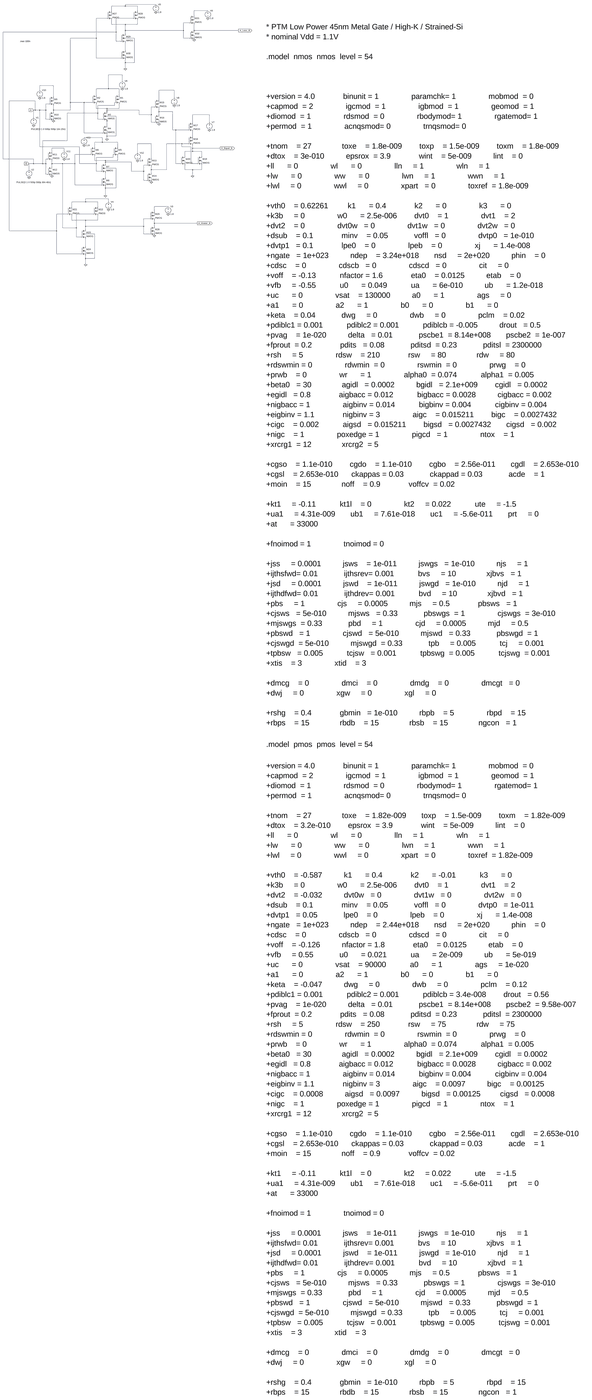
[diagram p0: schematic comparator-static-45nm.asc, whole sheet]
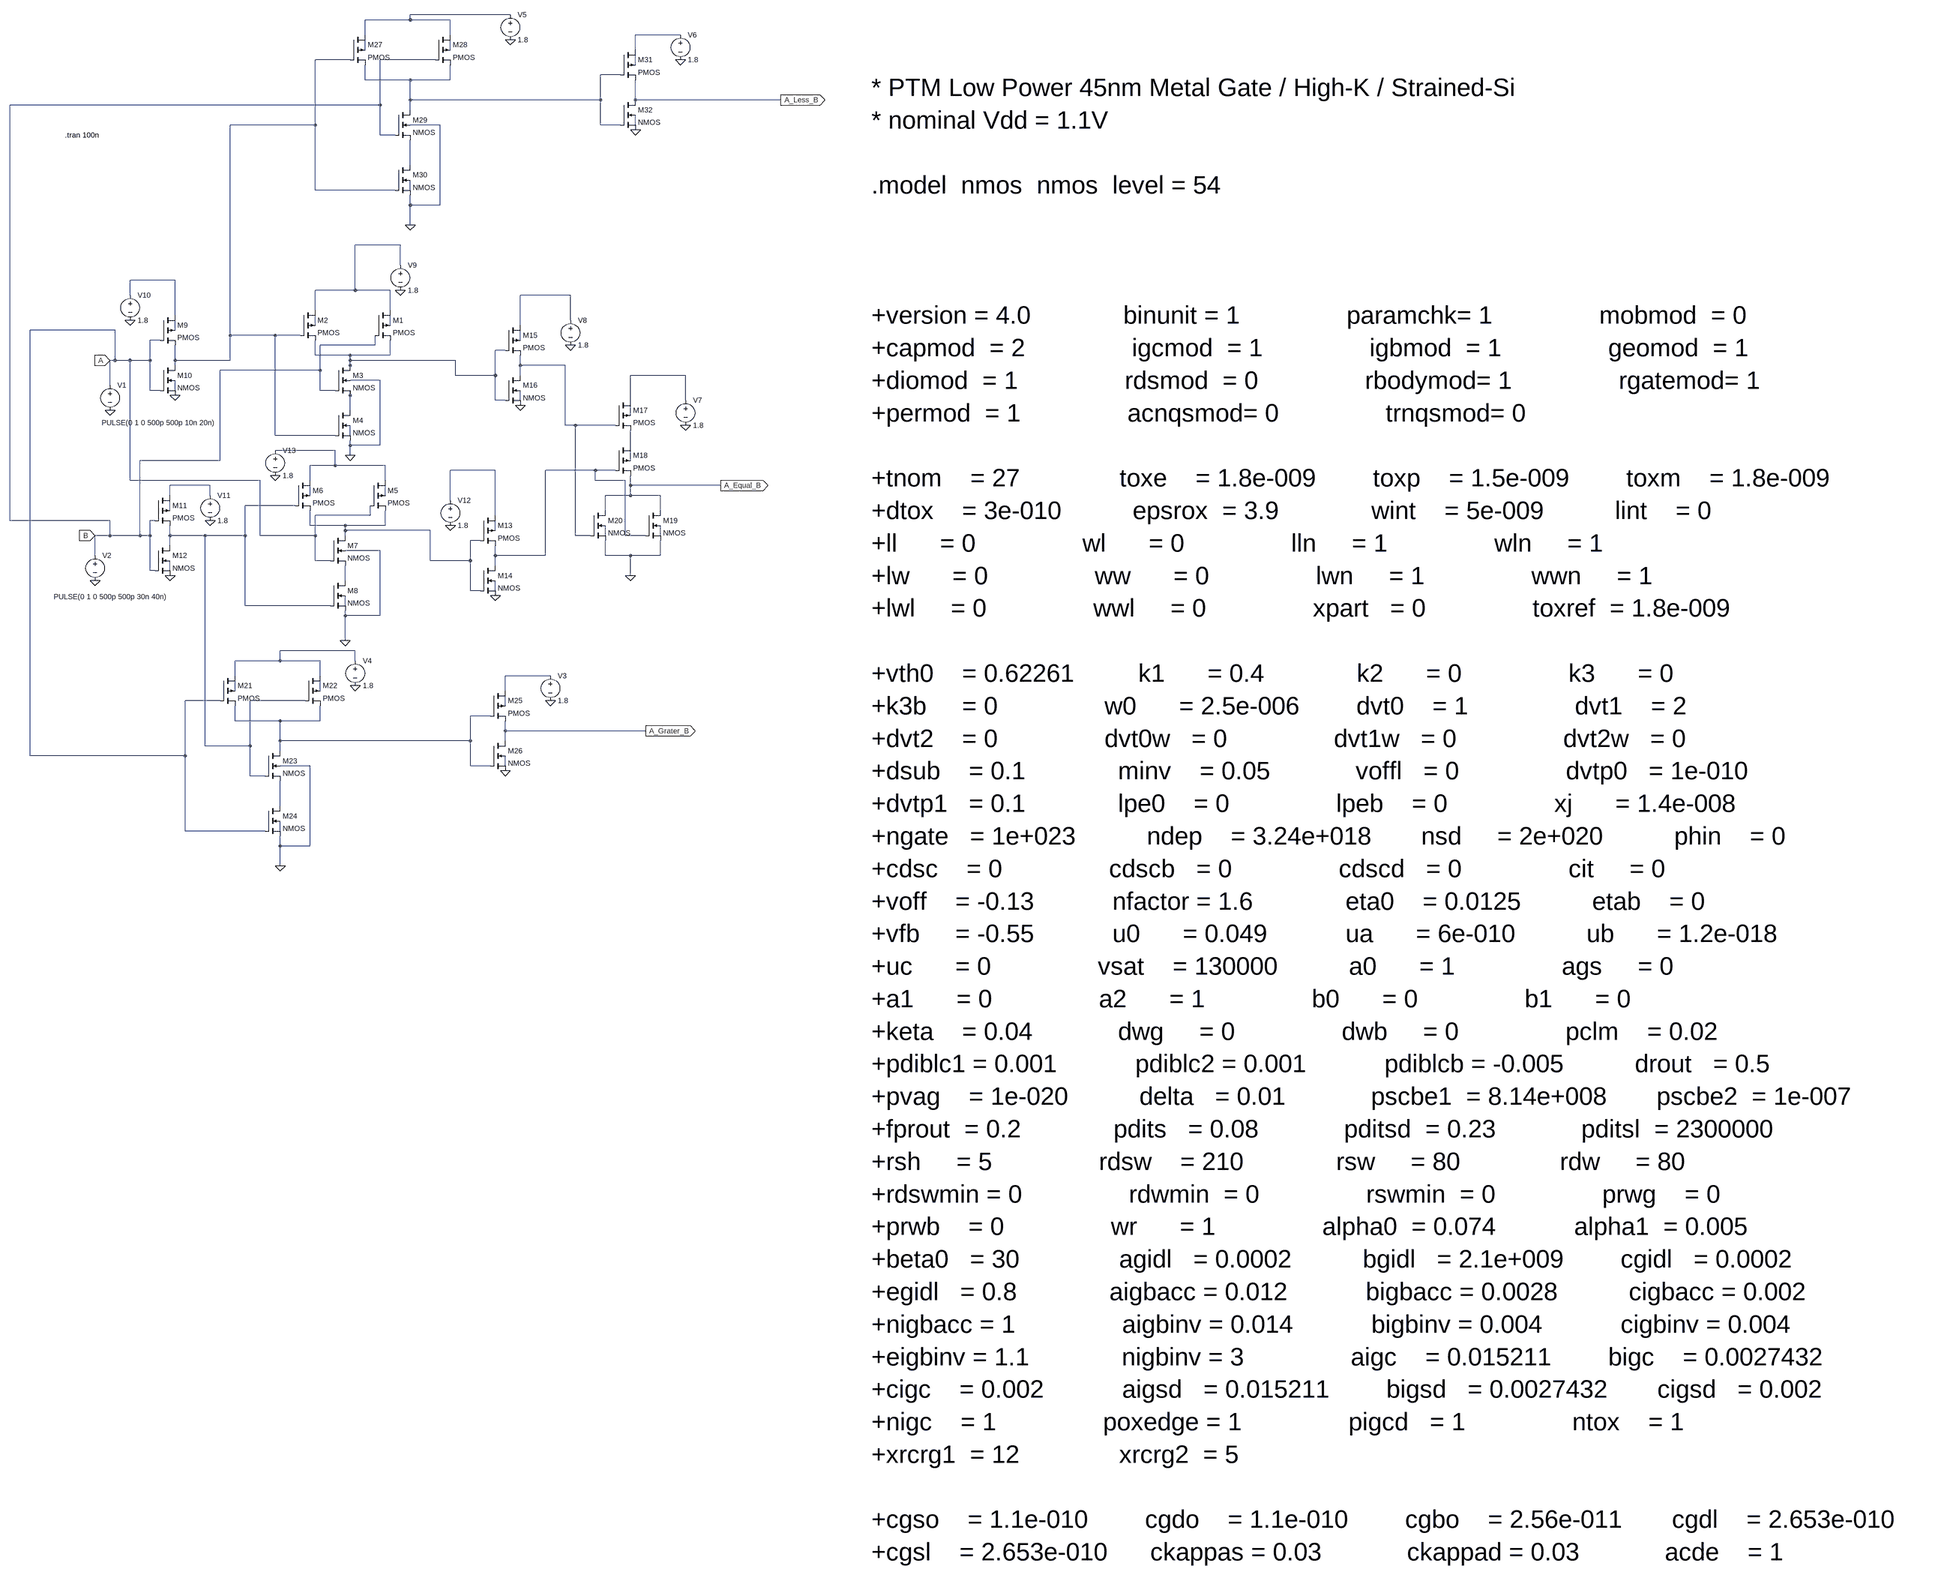
[diagram p1: schematic comparator-static-45nm.asc, part, row 1 of 3, column 1 of 1]
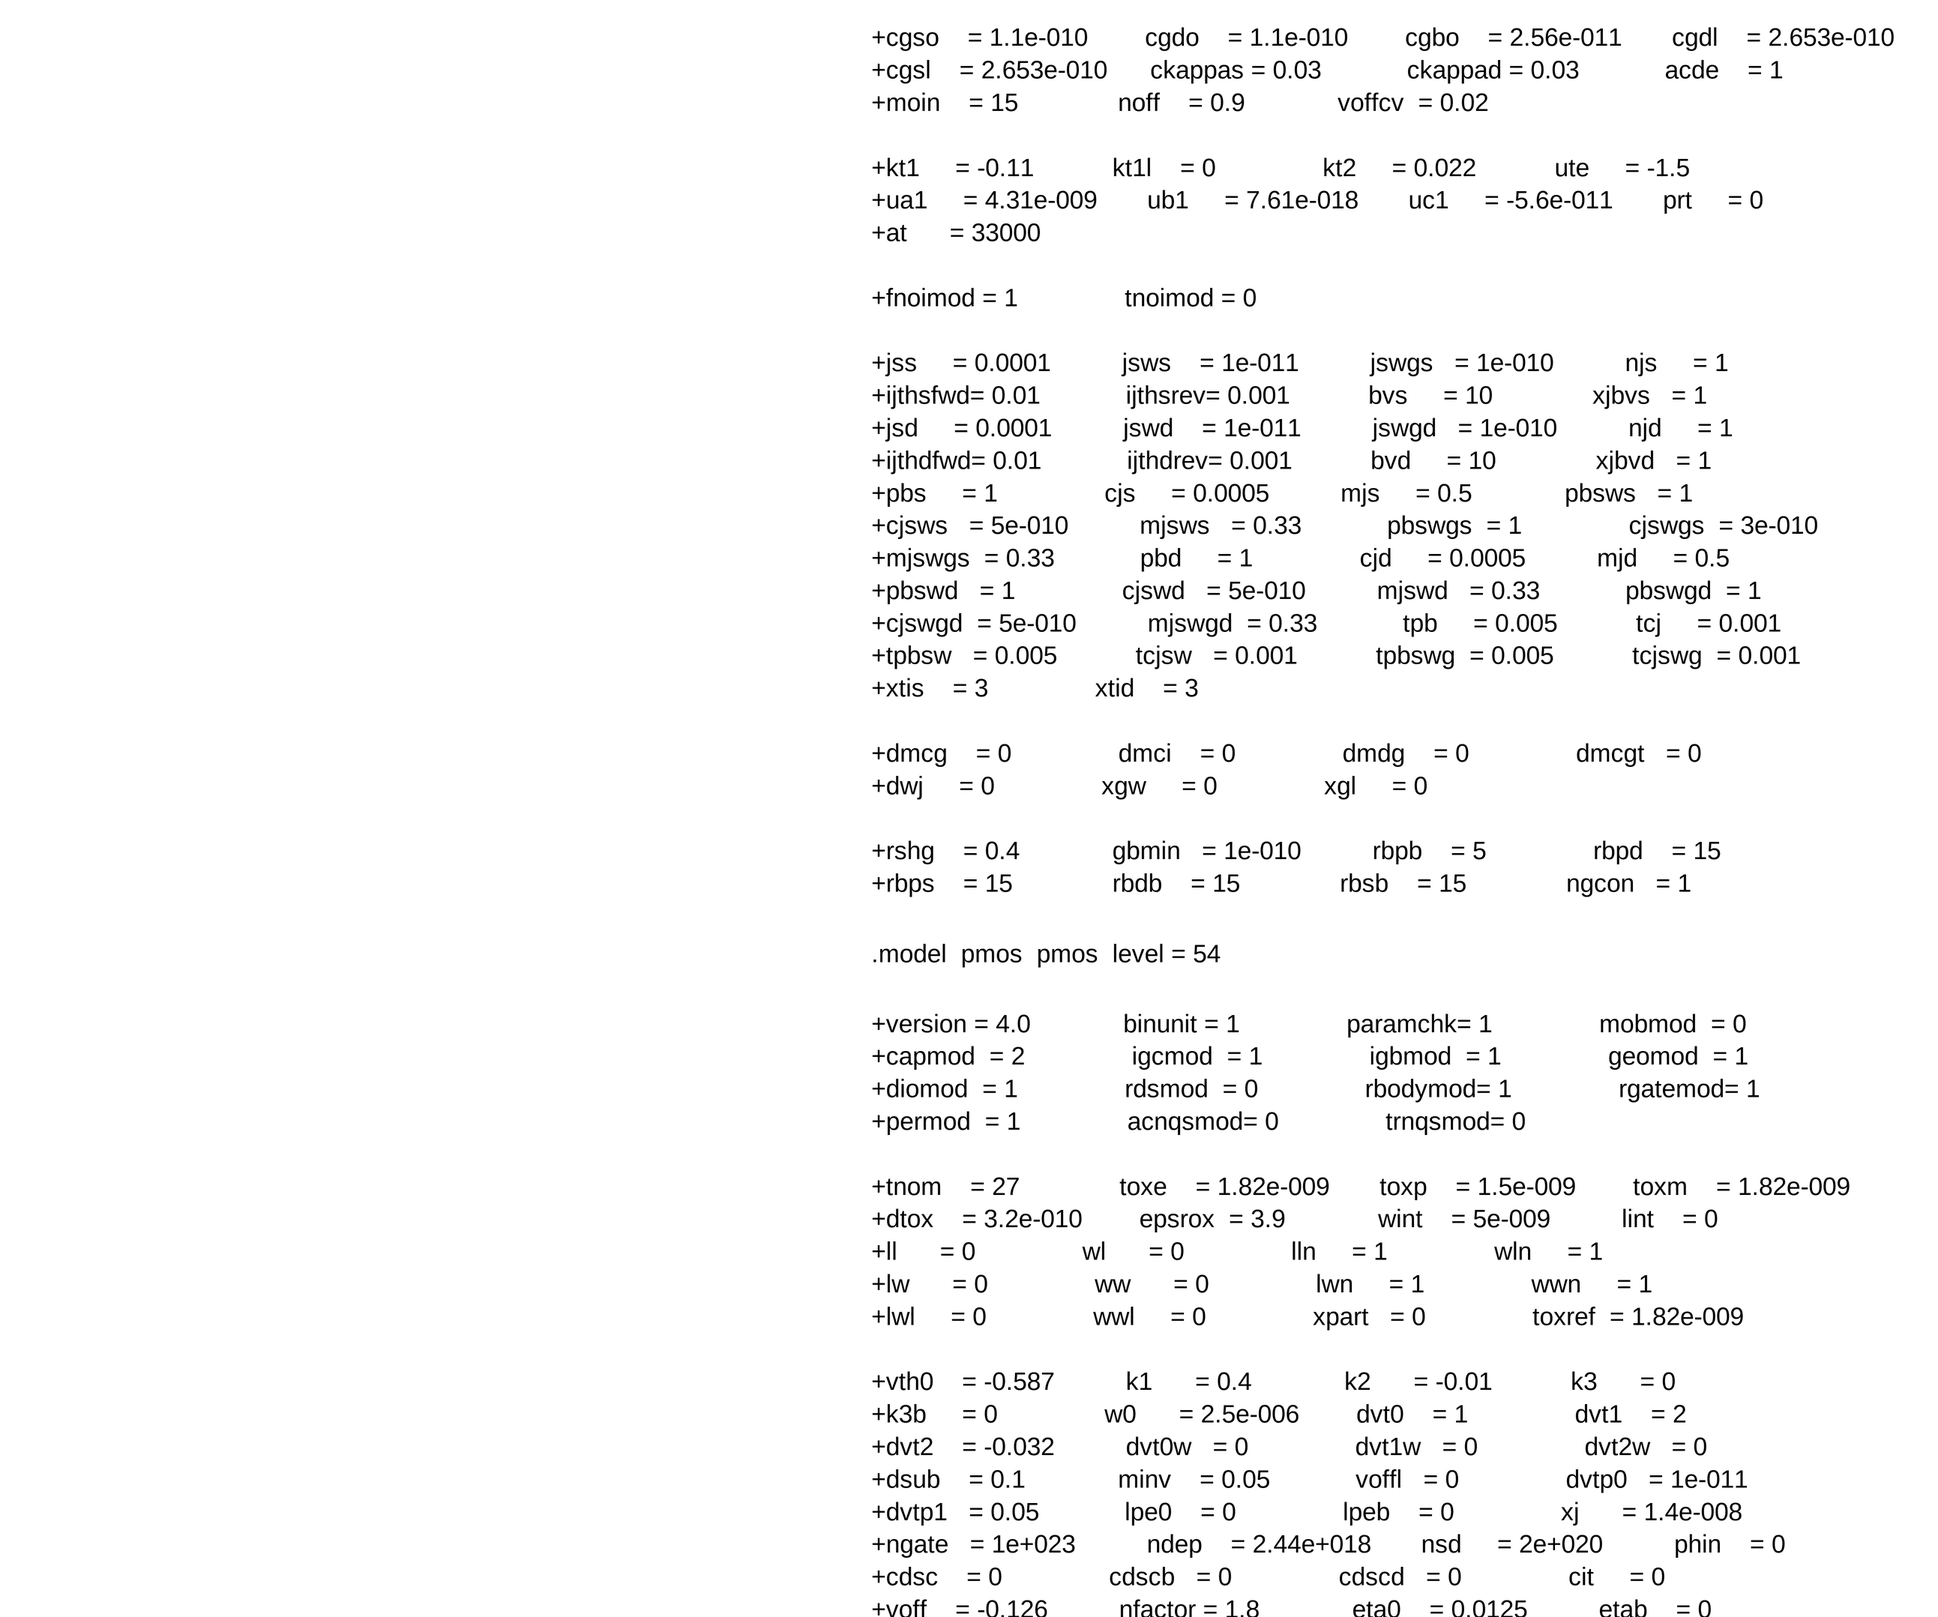
[diagram p2: schematic comparator-static-45nm.asc, part, row 2 of 3, column 1 of 1]
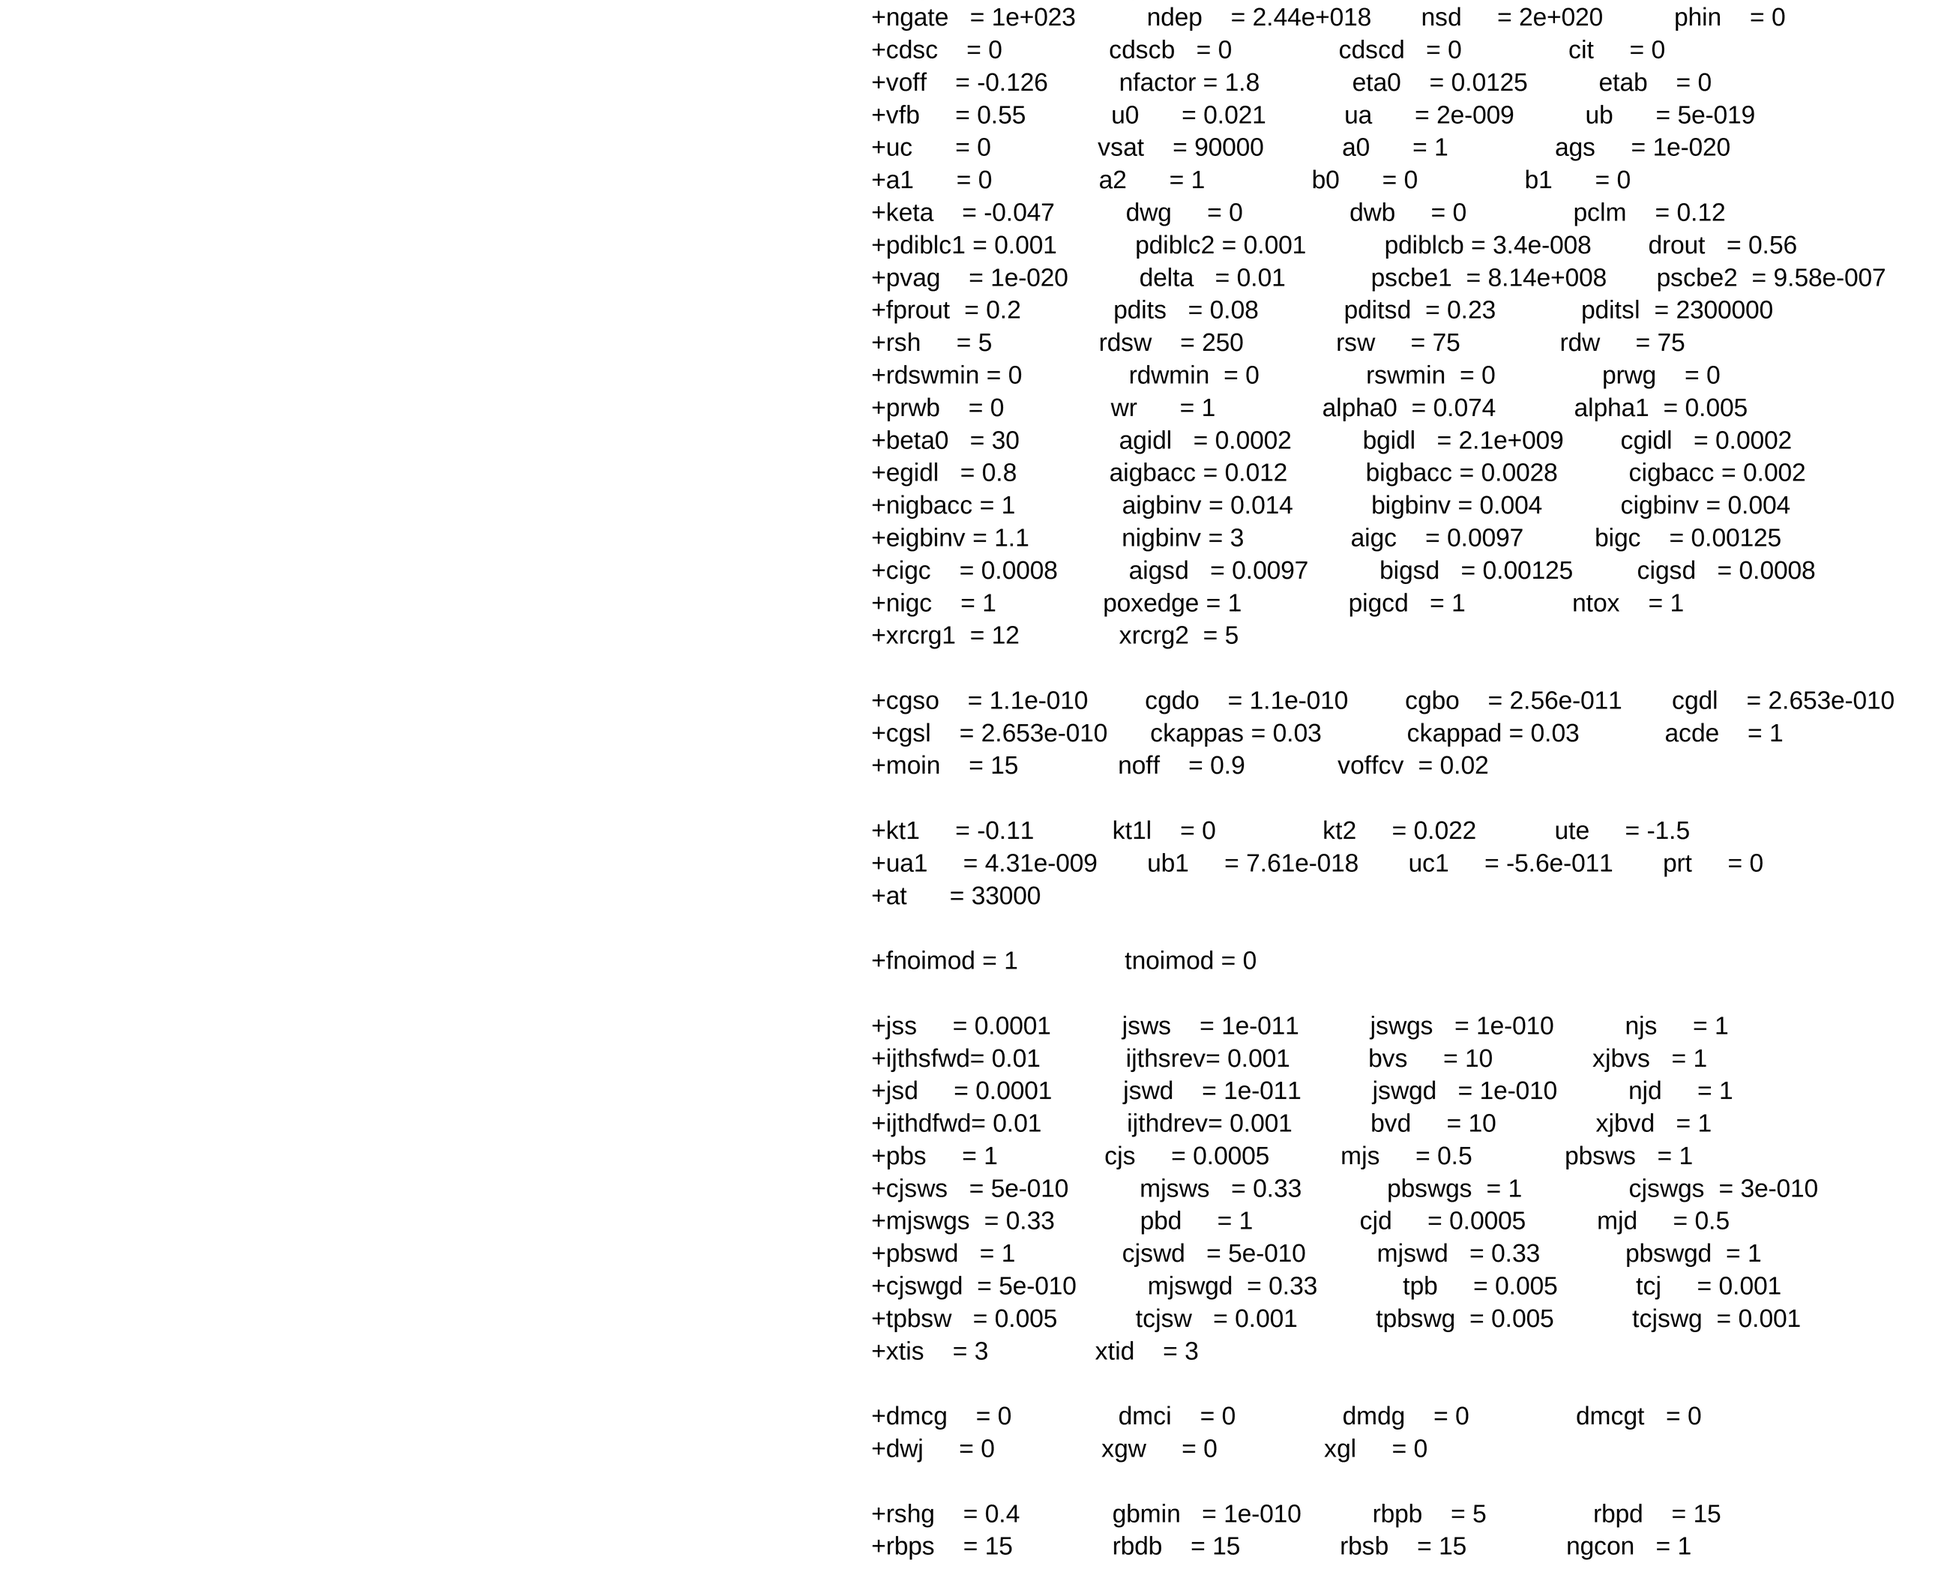
[diagram p3: schematic comparator-static-45nm.asc, part, row 3 of 3, column 1 of 1]
comparator-static-45nm.asc, the LTspice schematic file:
Version 4
SHEET 1 4696 9144
WIRE 672 -1056 352 -1056
WIRE 352 -1040 352 -1056
WIRE 352 -1040 208 -1040
WIRE 480 -1040 352 -1040
WIRE 208 -992 208 -1040
WIRE 480 -992 480 -1040
WIRE 1216 -992 1072 -992
WIRE 208 -944 208 -976
WIRE 480 -944 480 -976
WIRE 1072 -944 1072 -992
WIRE 160 -912 48 -912
WIRE 432 -912 256 -912
WIRE 1072 -896 1072 -928
WIRE 1024 -864 960 -864
WIRE 208 -848 208 -896
WIRE 352 -848 208 -848
WIRE 480 -848 480 -896
WIRE 480 -848 352 -848
WIRE 352 -784 352 -848
WIRE 960 -784 960 -864
WIRE 960 -784 352 -784
WIRE 1072 -784 1072 -848
WIRE 1536 -784 1072 -784
WIRE 256 -768 256 -912
WIRE 256 -768 -928 -768
WIRE 352 -752 352 -784
WIRE 48 -704 48 -912
WIRE 48 -704 -224 -704
WIRE 448 -704 352 -704
WIRE 960 -704 960 -784
WIRE 1024 -704 960 -704
WIRE 1072 -704 1072 -736
WIRE 256 -672 256 -768
WIRE 304 -672 256 -672
WIRE 352 -576 352 -656
WIRE 48 -496 48 -704
WIRE 304 -496 48 -496
WIRE 352 -496 352 -528
WIRE 352 -448 352 -480
WIRE 448 -448 448 -704
WIRE 448 -448 352 -448
WIRE 352 -384 352 -448
WIRE 320 -320 176 -320
WIRE 320 -256 320 -320
WIRE -400 -208 -544 -208
WIRE 176 -176 176 -320
WIRE 176 -176 48 -176
WIRE 288 -176 176 -176
WIRE -544 -160 -544 -208
WIRE 864 -160 704 -160
WIRE 48 -112 48 -176
WIRE 288 -112 288 -176
WIRE -400 -96 -400 -208
WIRE 864 -80 864 -160
WIRE 48 -64 48 -96
WIRE 288 -64 288 -96
WIRE 704 -64 704 -160
WIRE -592 -48 -864 -48
WIRE -400 -48 -400 -80
WIRE -224 -32 -224 -704
WIRE -80 -32 -224 -32
WIRE 0 -32 -80 -32
WIRE -448 -16 -480 -16
WIRE 704 -16 704 -48
WIRE 240 0 240 -32
WIRE 240 0 64 0
WIRE 656 16 624 16
WIRE 48 32 48 -16
WIRE 160 32 48 32
WIRE 288 32 288 -16
WIRE 288 32 160 32
WIRE -592 48 -592 -48
WIRE -592 48 -608 48
WIRE -544 48 -592 48
WIRE -480 48 -480 -16
WIRE -480 48 -544 48
WIRE -400 48 -400 0
WIRE -224 48 -224 -32
WIRE -224 48 -400 48
WIRE 160 48 160 32
WIRE 496 48 160 48
WIRE -400 64 -400 48
WIRE 160 64 160 48
WIRE 704 64 704 32
WIRE 848 64 704 64
WIRE 64 80 64 0
WIRE 64 80 -256 80
WIRE 160 80 160 64
WIRE 496 96 496 48
WIRE 624 96 624 16
WIRE 624 96 496 96
WIRE 704 96 704 64
WIRE 1232 96 1056 96
WIRE 256 112 160 112
WIRE -608 128 -608 48
WIRE -480 144 -480 48
WIRE -448 144 -480 144
WIRE -400 144 -400 112
WIRE 64 144 64 80
WIRE 112 144 64 144
WIRE 160 160 160 144
WIRE 624 176 624 96
WIRE 656 176 624 176
WIRE 704 176 704 144
WIRE 1056 176 1056 96
WIRE 1232 176 1232 96
WIRE 160 208 160 160
WIRE 1056 224 1056 192
WIRE 848 256 848 64
WIRE 880 256 848 256
WIRE 1008 256 880 256
WIRE -80 288 -80 -32
WIRE 112 288 -80 288
WIRE 160 288 160 256
WIRE 160 320 160 304
WIRE 256 320 256 112
WIRE 256 320 160 320
WIRE 1056 320 1056 272
WIRE 112 336 -80 336
WIRE 160 352 160 320
WIRE -256 368 -256 80
WIRE -256 368 -512 368
WIRE 1056 368 1056 336
WIRE 112 384 112 336
WIRE 112 384 32 384
WIRE 272 384 112 384
WIRE 624 400 480 400
WIRE 944 400 784 400
WIRE 1008 400 944 400
WIRE -544 432 -544 48
WIRE -128 432 -544 432
WIRE 32 432 32 384
WIRE 272 432 272 384
WIRE 944 432 944 400
WIRE 1040 432 944 432
WIRE -288 448 -416 448
WIRE 1056 448 1056 416
WIRE 1344 448 1056 448
WIRE -416 480 -416 448
WIRE -288 480 -288 448
WIRE 32 480 32 448
WIRE 272 480 272 448
WIRE 1056 480 1056 448
WIRE 1056 480 976 480
WIRE 1152 480 1056 480
WIRE 480 496 480 400
WIRE -16 512 -176 512
WIRE -416 528 -416 496
WIRE 976 528 976 480
WIRE 1152 528 1152 480
WIRE 224 544 224 512
WIRE 224 544 48 544
WIRE 624 544 624 400
WIRE -928 560 -928 -768
WIRE -608 560 -928 560
WIRE -464 560 -480 560
WIRE 32 576 32 528
WIRE 144 576 32 576
WIRE 272 576 272 528
WIRE 272 576 144 576
WIRE 144 592 144 576
WIRE 416 592 144 592
WIRE 624 592 624 560
WIRE -608 608 -608 560
WIRE -608 608 -656 608
WIRE -512 608 -512 368
WIRE -512 608 -608 608
WIRE -480 608 -480 560
WIRE -480 608 -512 608
WIRE -416 608 -416 576
WIRE -304 608 -416 608
WIRE -176 608 -176 512
WIRE -176 608 -304 608
WIRE -128 608 -128 432
WIRE 48 608 48 544
WIRE 48 608 -128 608
WIRE 144 608 144 592
WIRE 880 608 880 256
WIRE 928 608 880 608
WIRE 976 608 976 576
WIRE 1040 608 1040 432
WIRE 1104 608 1040 608
WIRE 1152 608 1152 576
WIRE 576 624 544 624
WIRE -416 640 -416 608
WIRE 256 656 144 656
WIRE -656 672 -656 608
WIRE 624 672 624 640
WIRE 784 672 784 400
WIRE 784 672 624 672
WIRE 976 672 976 624
WIRE 1056 672 976 672
WIRE 1152 672 1152 624
WIRE 1152 672 1056 672
WIRE 48 688 48 608
WIRE 96 688 48 688
WIRE 416 688 416 592
WIRE 544 688 544 624
WIRE 544 688 416 688
WIRE 624 704 624 672
WIRE -480 720 -480 608
WIRE -464 720 -480 720
WIRE -416 720 -416 688
WIRE 1056 736 1056 672
WIRE 144 752 144 704
WIRE 544 784 544 688
WIRE 576 784 544 784
WIRE 624 784 624 752
WIRE -176 832 -176 608
WIRE 96 832 -176 832
WIRE 144 832 144 800
WIRE 144 864 144 848
WIRE 256 864 256 656
WIRE 256 864 144 864
WIRE 144 944 144 864
WIRE 176 976 -64 976
WIRE -64 1008 -64 976
WIRE -64 1008 -208 1008
WIRE 64 1008 -64 1008
WIRE 176 1008 176 976
WIRE -208 1056 -208 1008
WIRE 64 1056 64 1008
WIRE 800 1056 656 1056
WIRE -208 1104 -208 1072
WIRE 64 1104 64 1072
WIRE 656 1104 656 1056
WIRE -256 1136 -368 1136
WIRE 16 1136 -160 1136
WIRE 656 1152 656 1120
WIRE 608 1184 544 1184
WIRE -208 1200 -208 1152
WIRE -64 1200 -208 1200
WIRE 64 1200 64 1152
WIRE 64 1200 -64 1200
WIRE 656 1232 656 1200
WIRE 1104 1232 656 1232
WIRE -64 1264 -64 1200
WIRE 544 1264 544 1184
WIRE 544 1264 -64 1264
WIRE 656 1264 656 1232
WIRE -304 1280 -304 608
WIRE -160 1280 -160 1136
WIRE -160 1280 -304 1280
WIRE -64 1296 -64 1264
WIRE -864 1312 -864 -48
WIRE -368 1312 -368 1136
WIRE -368 1312 -864 1312
WIRE 32 1344 -64 1344
WIRE 544 1344 544 1264
WIRE 608 1344 544 1344
WIRE 656 1344 656 1312
WIRE -160 1376 -160 1280
WIRE -112 1376 -160 1376
WIRE -64 1472 -64 1392
WIRE -368 1552 -368 1312
WIRE -112 1552 -368 1552
WIRE -64 1552 -64 1520
WIRE -64 1600 -64 1568
WIRE 32 1600 32 1344
WIRE 32 1600 -64 1600
WIRE -64 1664 -64 1600
FLAG 160 352 0
FLAG 144 944 0
FLAG -416 736 0
FLAG -400 160 0
FLAG 624 800 0
FLAG 704 192 0
FLAG 1056 736 0
FLAG -608 208 0
FLAG -656 752 0
FLAG -608 48 A
IOPIN -608 48 In
FLAG -656 608 B
IOPIN -656 608 In
FLAG 1344 448 A_Equal_B
IOPIN 1344 448 Out
FLAG 352 -384 0
FLAG 672 -976 0
FLAG 1536 -784 A_Less_B
IOPIN 1536 -784 Out
FLAG 1072 -688 0
FLAG 1216 -912 0
FLAG 1232 256 0
FLAG 864 0 0
FLAG 320 -176 0
FLAG -544 -80 0
FLAG -288 560 0
FLAG 480 576 0
FLAG -80 416 0
FLAG -64 1664 0
FLAG 656 1360 0
FLAG 800 1136 0
FLAG 176 1088 0
FLAG 1104 1232 A_Grater_B
IOPIN 1104 1232 Out
SYMBOL pmos4 240 -112 R0
SYMATTR InstName M1
SYMATTR Value2 l=45nm w=135nm
SYMBOL pmos4 0 -112 R0
SYMATTR InstName M2
SYMATTR Value2 l=45nm w=135nm
SYMBOL nmos4 112 64 R0
SYMATTR InstName M3
SYMATTR Value2 l=45nm w=135nm
SYMBOL nmos4 112 208 R0
SYMATTR InstName M4
SYMATTR Value2 l=45nm w=135nm
SYMBOL pmos4 224 432 R0
SYMATTR InstName M5
SYMATTR Value2 l=45nm w=135nm
SYMBOL pmos4 -16 432 R0
SYMATTR InstName M6
SYMATTR Value2 l=45nm w=135nm
SYMBOL nmos4 96 608 R0
SYMATTR InstName M7
SYMATTR Value2 l=45nm w=135nm
SYMBOL nmos4 96 752 R0
SYMATTR InstName M8
SYMATTR Value2 l=45nm w=135nm
SYMBOL pmos4 -448 -96 R0
SYMATTR InstName M9
SYMATTR Value2 l=45nm w=135nm
SYMBOL nmos4 -448 64 R0
SYMATTR InstName M10
SYMATTR Value2 l=45nm w=135nm
SYMBOL pmos4 -464 480 R0
SYMATTR InstName M11
SYMATTR Value2 l=45nm w=135nm
SYMBOL nmos4 -464 640 R0
SYMATTR InstName M12
SYMATTR Value2 l=45nm w=135nm
SYMBOL pmos4 576 544 R0
SYMATTR InstName M13
SYMATTR Value2 l=45nm w=135nm
SYMBOL nmos4 576 704 R0
SYMATTR InstName M14
SYMATTR Value2 l=45nm w=135nm
SYMBOL pmos4 656 -64 R0
SYMATTR InstName M15
SYMATTR Value2 l=45nm w=135nm
SYMBOL nmos4 656 96 R0
SYMATTR InstName M16
SYMATTR Value2 l=45nm w=135nm
SYMBOL pmos4 1008 176 R0
SYMATTR InstName M17
SYMATTR Value2 l=45nm w=135nm
SYMBOL pmos4 1008 320 R0
SYMATTR InstName M18
SYMATTR Value2 l=45nm w=135nm
SYMBOL nmos4 1104 528 R0
SYMATTR InstName M19
SYMATTR Value2 l=45nm w=135nm
SYMBOL nmos4 928 528 R0
SYMATTR InstName M20
SYMATTR Value2 l=45nm w=135nm
SYMBOL voltage -608 112 R0
WINDOW 3 -27 136 Left 2
WINDOW 123 0 0 Left 0
WINDOW 39 0 0 Left 0
SYMATTR Value PULSE(0 1 0 500p 500p 10n 20n)
SYMATTR InstName V1
SYMBOL voltage -656 656 R0
WINDOW 3 -132 148 Left 2
WINDOW 123 0 0 Left 0
WINDOW 39 0 0 Left 0
SYMATTR Value PULSE(0 1 0 500p 500p 30n 40n)
SYMATTR InstName V2
SYMBOL pmos4 160 -992 R0
SYMATTR InstName M27
SYMATTR Value2 l=45nm w=135nm
SYMBOL pmos4 432 -992 R0
SYMATTR InstName M28
SYMATTR Value2 l=45nm w=135nm
SYMBOL nmos4 304 -752 R0
SYMATTR InstName M29
SYMATTR Value2 l=45nm w=135nm
SYMBOL nmos4 304 -576 R0
SYMATTR InstName M30
SYMATTR Value2 l=45nm w=135nm
SYMBOL voltage 672 -1072 R0
WINDOW 123 0 0 Left 0
WINDOW 39 0 0 Left 0
SYMATTR InstName V5
SYMATTR Value 1.8
SYMBOL pmos4 1024 -944 R0
SYMATTR InstName M31
SYMATTR Value2 l=45nm w=135nm
SYMBOL nmos4 1024 -784 R0
SYMATTR InstName M32
SYMATTR Value2 l=45nm w=135nm
SYMBOL voltage 1216 -1008 R0
WINDOW 123 0 0 Left 0
WINDOW 39 0 0 Left 0
SYMATTR InstName V6
SYMATTR Value 1.8
SYMBOL voltage 1232 160 R0
WINDOW 123 0 0 Left 0
WINDOW 39 0 0 Left 0
SYMATTR InstName V7
SYMATTR Value 1.8
SYMBOL voltage 864 -96 R0
WINDOW 123 0 0 Left 0
WINDOW 39 0 0 Left 0
SYMATTR InstName V8
SYMATTR Value 1.8
SYMBOL voltage 320 -272 R0
WINDOW 123 0 0 Left 0
WINDOW 39 0 0 Left 0
SYMATTR InstName V9
SYMATTR Value 1.8
SYMBOL voltage -544 -176 R0
WINDOW 123 0 0 Left 0
WINDOW 39 0 0 Left 0
SYMATTR InstName V10
SYMATTR Value 1.8
SYMBOL voltage -288 464 R0
WINDOW 123 0 0 Left 0
WINDOW 39 0 0 Left 0
SYMATTR InstName V11
SYMATTR Value 1.8
SYMBOL voltage 480 480 R0
WINDOW 123 0 0 Left 0
WINDOW 39 0 0 Left 0
SYMATTR InstName V12
SYMATTR Value 1.8
SYMBOL voltage -80 320 R0
WINDOW 123 0 0 Left 0
WINDOW 39 0 0 Left 0
SYMATTR InstName V13
SYMATTR Value 1.8
SYMBOL pmos4 -256 1056 R0
SYMATTR InstName M21
SYMATTR Value2 l=45nm w=135nm
SYMBOL pmos4 16 1056 R0
SYMATTR InstName M22
SYMATTR Value2 l=45nm w=135nm
SYMBOL nmos4 -112 1296 R0
SYMATTR InstName M23
SYMATTR Value2 l=45nm w=135nm
SYMBOL nmos4 -112 1472 R0
SYMATTR InstName M24
SYMATTR Value2 l=45nm w=135nm
SYMBOL pmos4 608 1104 R0
SYMATTR InstName M25
SYMATTR Value2 l=45nm w=135nm
SYMBOL nmos4 608 1264 R0
SYMATTR InstName M26
SYMATTR Value2 l=45nm w=135nm
SYMBOL voltage 800 1040 R0
WINDOW 123 0 0 Left 0
WINDOW 39 0 0 Left 0
SYMATTR InstName V3
SYMATTR Value 1.8
SYMBOL voltage 176 992 R0
WINDOW 123 0 0 Left 0
WINDOW 39 0 0 Left 0
SYMATTR InstName V4
SYMATTR Value 1.8
TEXT -752 -672 Left 2 !.tran 100n
TEXT 1832 -824 Left 6 !* PTM Low Power 45nm Metal Gate / High-K / Strained-Si\n* nominal Vdd = 1.1V\n \n.model  nmos  nmos  level = 54\n \n\n \n+version = 4.0             binunit = 1               paramchk= 1               mobmod  = 0             \n+capmod  = 2               igcmod  = 1               igbmod  = 1               geomod  = 1             \n+diomod  = 1               rdsmod  = 0               rbodymod= 1               rgatemod= 1             \n+permod  = 1               acnqsmod= 0               trnqsmod= 0             \n \n+tnom    = 27              toxe    = 1.8e-009        toxp    = 1.5e-009        toxm    = 1.8e-009      \n+dtox    = 3e-010          epsrox  = 3.9             wint    = 5e-009          lint    = 0             \n+ll      = 0               wl      = 0               lln     = 1               wln     = 1             \n+lw      = 0               ww      = 0               lwn     = 1               wwn     = 1             \n+lwl     = 0               wwl     = 0               xpart   = 0               toxref  = 1.8e-009      \n \n+vth0    = 0.62261         k1      = 0.4             k2      = 0               k3      = 0             \n+k3b     = 0               w0      = 2.5e-006        dvt0    = 1               dvt1    = 2             \n+dvt2    = 0               dvt0w   = 0               dvt1w   = 0               dvt2w   = 0             \n+dsub    = 0.1             minv    = 0.05            voffl   = 0               dvtp0   = 1e-010        \n+dvtp1   = 0.1             lpe0    = 0               lpeb    = 0               xj      = 1.4e-008      \n+ngate   = 1e+023          ndep    = 3.24e+018       nsd     = 2e+020          phin    = 0             \n+cdsc    = 0               cdscb   = 0               cdscd   = 0               cit     = 0             \n+voff    = -0.13           nfactor = 1.6             eta0    = 0.0125          etab    = 0             \n+vfb     = -0.55           u0      = 0.049           ua      = 6e-010          ub      = 1.2e-018      \n+uc      = 0               vsat    = 130000          a0      = 1               ags     = 0             \n+a1      = 0               a2      = 1               b0      = 0               b1      = 0             \n+keta    = 0.04            dwg     = 0               dwb     = 0               pclm    = 0.02          \n+pdiblc1 = 0.001           pdiblc2 = 0.001           pdiblcb = -0.005          drout   = 0.5           \n+pvag    = 1e-020          delta   = 0.01            pscbe1  = 8.14e+008       pscbe2  = 1e-007        \n+fprout  = 0.2             pdits   = 0.08            pditsd  = 0.23            pditsl  = 2300000       \n+rsh     = 5               rdsw    = 210             rsw     = 80              rdw     = 80            \n+rdswmin = 0               rdwmin  = 0               rswmin  = 0               prwg    = 0             \n+prwb    = 0               wr      = 1               alpha0  = 0.074           alpha1  = 0.005         \n+beta0   = 30              agidl   = 0.0002          bgidl   = 2.1e+009        cgidl   = 0.0002        \n+egidl   = 0.8             aigbacc = 0.012           bigbacc = 0.0028          cigbacc = 0.002         \n+nigbacc = 1               aigbinv = 0.014           bigbinv = 0.004           cigbinv = 0.004         \n+eigbinv = 1.1             nigbinv = 3               aigc    = 0.015211        bigc    = 0.0027432     \n+cigc    = 0.002           aigsd   = 0.015211        bigsd   = 0.0027432       cigsd   = 0.002         \n+nigc    = 1               poxedge = 1               pigcd   = 1               ntox    = 1             \n+xrcrg1  = 12              xrcrg2  = 5             \n \n+cgso    = 1.1e-010        cgdo    = 1.1e-010        cgbo    = 2.56e-011       cgdl    = 2.653e-010    \n+cgsl    = 2.653e-010      ckappas = 0.03            ckappad = 0.03            acde    = 1             \n+moin    = 15              noff    = 0.9             voffcv  = 0.02          \n \n+kt1     = -0.11           kt1l    = 0               kt2     = 0.022           ute     = -1.5          \n+ua1     = 4.31e-009       ub1     = 7.61e-018       uc1     = -5.6e-011       prt     = 0             \n+at      = 33000         \n \n+fnoimod = 1               tnoimod = 0             \n \n+jss     = 0.0001          jsws    = 1e-011          jswgs   = 1e-010          njs     = 1             \n+ijthsfwd= 0.01            ijthsrev= 0.001           bvs     = 10              xjbvs   = 1             \n+jsd     = 0.0001          jswd    = 1e-011          jswgd   = 1e-010          njd     = 1             \n+ijthdfwd= 0.01            ijthdrev= 0.001           bvd     = 10              xjbvd   = 1             \n+pbs     = 1               cjs     = 0.0005          mjs     = 0.5             pbsws   = 1             \n+cjsws   = 5e-010          mjsws   = 0.33            pbswgs  = 1               cjswgs  = 3e-010        \n+mjswgs  = 0.33            pbd     = 1               cjd     = 0.0005          mjd     = 0.5           \n+pbswd   = 1               cjswd   = 5e-010          mjswd   = 0.33            pbswgd  = 1             \n+cjswgd  = 5e-010          mjswgd  = 0.33            tpb     = 0.005           tcj     = 0.001         \n+tpbsw   = 0.005           tcjsw   = 0.001           tpbswg  = 0.005           tcjswg  = 0.001         \n+xtis    = 3               xtid    = 3             \n \n+dmcg    = 0               dmci    = 0               dmdg    = 0               dmcgt   = 0             \n+dwj     = 0               xgw     = 0               xgl     = 0             \n \n+rshg    = 0.4             gbmin   = 1e-010          rbpb    = 5               rbpd    = 15            \n+rbps    = 15              rbdb    = 15              rbsb    = 15              ngcon   = 1             \n \n\n.model  pmos  pmos  level = 54\n \n\n+version = 4.0             binunit = 1               paramchk= 1               mobmod  = 0             \n+capmod  = 2               igcmod  = 1               igbmod  = 1               geomod  = 1             \n+diomod  = 1               rdsmod  = 0               rbodymod= 1               rgatemod= 1             \n+permod  = 1               acnqsmod= 0               trnqsmod= 0             \n \n+tnom    = 27              toxe    = 1.82e-009       toxp    = 1.5e-009        toxm    = 1.82e-009     \n+dtox    = 3.2e-010        epsrox  = 3.9             wint    = 5e-009          lint    = 0             \n+ll      = 0               wl      = 0               lln     = 1               wln     = 1             \n+lw      = 0               ww      = 0               lwn     = 1               wwn     = 1             \n+lwl     = 0               wwl     = 0               xpart   = 0               toxref  = 1.82e-009     \n \n+vth0    = -0.587          k1      = 0.4             k2      = -0.01           k3      = 0             \n+k3b     = 0               w0      = 2.5e-006        dvt0    = 1               dvt1    = 2             \n+dvt2    = -0.032          dvt0w   = 0               dvt1w   = 0               dvt2w   = 0             \n+dsub    = 0.1             minv    = 0.05            voffl   = 0               dvtp0   = 1e-011        \n+dvtp1   = 0.05            lpe0    = 0               lpeb    = 0               xj      = 1.4e-008      \n+ngate   = 1e+023          ndep    = 2.44e+018       nsd     = 2e+020          phin    = 0             \n+cdsc    = 0               cdscb   = 0               cdscd   = 0               cit     = 0             \n+voff    = -0.126          nfactor = 1.8             eta0    = 0.0125          etab    = 0             \n+vfb     = 0.55            u0      = 0.021           ua      = 2e-009          ub      = 5e-019        \n+uc      = 0               vsat    = 90000           a0      = 1               ags     = 1e-020        \n+a1      = 0               a2      = 1               b0      = 0               b1      = 0             \n+keta    = -0.047          dwg     = 0               dwb     = 0               pclm    = 0.12          \n+pdiblc1 = 0.001           pdiblc2 = 0.001           pdiblcb = 3.4e-008        drout   = 0.56          \n+pvag    = 1e-020          delta   = 0.01            pscbe1  = 8.14e+008       pscbe2  = 9.58e-007     \n+fprout  = 0.2             pdits   = 0.08            pditsd  = 0.23            pditsl  = 2300000       \n+rsh     = 5               rdsw    = 250             rsw     = 75              rdw     = 75            \n+rdswmin = 0               rdwmin  = 0               rswmin  = 0               prwg    = 0             \n+prwb    = 0               wr      = 1               alpha0  = 0.074           alpha1  = 0.005         \n+beta0   = 30              agidl   = 0.0002          bgidl   = 2.1e+009        cgidl   = 0.0002        \n+egidl   = 0.8             aigbacc = 0.012           bigbacc = 0.0028          cigbacc = 0.002         \n+nigbacc = 1               aigbinv = 0.014           bigbinv = 0.004           cigbinv = 0.004         \n+eigbinv = 1.1             nigbinv = 3               aigc    = 0.0097          bigc    = 0.00125       \n+cigc    = 0.0008          aigsd   = 0.0097          bigsd   = 0.00125         cigsd   = 0.0008        \n+nigc    = 1               poxedge = 1               pigcd   = 1               ntox    = 1             \n+xrcrg1  = 12              xrcrg2  = 5             \n \n+cgso    = 1.1e-010        cgdo    = 1.1e-010        cgbo    = 2.56e-011       cgdl    = 2.653e-010    \n+cgsl    = 2.653e-010      ckappas = 0.03            ckappad = 0.03            acde    = 1             \n+moin    = 15              noff    = 0.9             voffcv  = 0.02          \n \n+kt1     = -0.11           kt1l    = 0               kt2     = 0.022           ute     = -1.5          \n+ua1     = 4.31e-009       ub1     = 7.61e-018       uc1     = -5.6e-011       prt     = 0             \n+at      = 33000         \n \n+fnoimod = 1               tnoimod = 0             \n \n+jss     = 0.0001          jsws    = 1e-011          jswgs   = 1e-010          njs     = 1             \n+ijthsfwd= 0.01            ijthsrev= 0.001           bvs     = 10              xjbvs   = 1             \n+jsd     = 0.0001          jswd    = 1e-011          jswgd   = 1e-010          njd     = 1             \n+ijthdfwd= 0.01            ijthdrev= 0.001           bvd     = 10              xjbvd   = 1             \n+pbs     = 1               cjs     = 0.0005          mjs     = 0.5             pbsws   = 1             \n+cjsws   = 5e-010          mjsws   = 0.33            pbswgs  = 1               cjswgs  = 3e-010        \n+mjswgs  = 0.33            pbd     = 1               cjd     = 0.0005          mjd     = 0.5           \n+pbswd   = 1               cjswd   = 5e-010          mjswd   = 0.33            pbswgd  = 1             \n+cjswgd  = 5e-010          mjswgd  = 0.33            tpb     = 0.005           tcj     = 0.001         \n+tpbsw   = 0.005           tcjsw   = 0.001           tpbswg  = 0.005           tcjswg  = 0.001         \n+xtis    = 3               xtid    = 3             \n \n+dmcg    = 0               dmci    = 0               dmdg    = 0               dmcgt   = 0             \n+dwj     = 0               xgw     = 0               xgl     = 0             \n \n+rshg    = 0.4             gbmin   = 1e-010          rbpb    = 5               rbpd    = 15            \n+rbps    = 15              rbdb    = 15              rbsb    = 15              ngcon   = 1

The netlist it stands for:
* comparator-static-45nm.asc
M1 N011 B N018 N015 PMOS l=45nm w=135nm
M2 N011 N005 N018 N014 PMOS l=45nm w=135nm
M3 N018 B N022 0 NMOS l=45nm w=135nm
M4 N022 N005 0 N025 NMOS l=45nm w=135nm
M5 N027 A N036 N033 PMOS l=45nm w=135nm
M6 N027 N034 N036 N032 PMOS l=45nm w=135nm
M7 N036 A N041 0 NMOS l=45nm w=135nm
M8 N041 N034 0 N043 NMOS l=45nm w=135nm
M9 N012 A N005 N016 PMOS l=45nm w=135nm
M10 N005 A 0 N021 NMOS l=45nm w=135nm
M11 N031 B N034 N035 PMOS l=45nm w=135nm
M12 N034 B 0 N040 NMOS l=45nm w=135nm
M13 N029 N036 N030 N037 PMOS l=45nm w=135nm
M14 N030 N036 0 N042 NMOS l=45nm w=135nm
M15 N013 N018 N019 N017 PMOS l=45nm w=135nm
M16 N019 N018 0 N023 NMOS l=45nm w=135nm
M17 N020 N019 N026 N024 PMOS l=45nm w=135nm
M18 N026 N030 A_Equal_B N028 PMOS l=45nm w=135nm
M19 A_Equal_B N030 0 N039 NMOS l=45nm w=135nm
M20 A_Equal_B N019 0 N038 NMOS l=45nm w=135nm
V1 A 0 PULSE(0 1 0 500p 500p 10n 20n)
V2 B 0 PULSE(0 1 0 500p 500p 30n 40n)
M27 N001 N005 N007 N003 PMOS l=45nm w=135nm
M28 N001 B N007 N004 PMOS l=45nm w=135nm
M29 N007 B N009 0 NMOS l=45nm w=135nm
M30 N009 N005 0 N010 NMOS l=45nm w=135nm
V5 N001 0 1.8
M31 N002 N007 A_Less_B N006 PMOS l=45nm w=135nm
M32 A_Less_B N007 0 N008 NMOS l=45nm w=135nm
V6 N002 0 1.8
V7 N020 0 1.8
V8 N013 0 1.8
V9 N011 0 1.8
V10 N012 0 1.8
V11 N031 0 1.8
V12 N029 0 1.8
V13 N027 0 1.8
M21 N044 A N049 N046 PMOS l=45nm w=135nm
M22 N044 N034 N049 N047 PMOS l=45nm w=135nm
M23 N049 N034 N051 0 NMOS l=45nm w=135nm
M24 N051 A 0 N052 NMOS l=45nm w=135nm
M25 N045 N049 A_Grater_B N048 PMOS l=45nm w=135nm
M26 A_Grater_B N049 0 N050 NMOS l=45nm w=135nm
V3 N045 0 1.8
V4 N044 0 1.8
.model NMOS NMOS
.model PMOS PMOS
.lib standard.mos
.tran 100n
* PTM Low Power 45nm Metal Gate / High-K / Strained-Si
* nominal Vdd = 1.1V
.model  nmos  nmos  level = 54
+version = 4.0             binunit = 1               paramchk= 1               mobmod  = 0
+capmod  = 2               igcmod  = 1               igbmod  = 1               geomod  = 1
+diomod  = 1               rdsmod  = 0               rbodymod= 1               rgatemod= 1
+permod  = 1               acnqsmod= 0               trnqsmod= 0
+tnom    = 27              toxe    = 1.8e-009        toxp    = 1.5e-009        toxm    = 1.8e-009
+dtox    = 3e-010          epsrox  = 3.9             wint    = 5e-009          lint    = 0
+ll      = 0               wl      = 0               lln     = 1               wln     = 1
+lw      = 0               ww      = 0               lwn     = 1               wwn     = 1
+lwl     = 0               wwl     = 0               xpart   = 0               toxref  = 1.8e-009
+vth0    = 0.62261         k1      = 0.4             k2      = 0               k3      = 0
+k3b     = 0               w0      = 2.5e-006        dvt0    = 1               dvt1    = 2
+dvt2    = 0               dvt0w   = 0               dvt1w   = 0               dvt2w   = 0
+dsub    = 0.1             minv    = 0.05            voffl   = 0               dvtp0   = 1e-010
+dvtp1   = 0.1             lpe0    = 0               lpeb    = 0               xj      = 1.4e-008
+ngate   = 1e+023          ndep    = 3.24e+018       nsd     = 2e+020          phin    = 0
+cdsc    = 0               cdscb   = 0               cdscd   = 0               cit     = 0
+voff    = -0.13           nfactor = 1.6             eta0    = 0.0125          etab    = 0
+vfb     = -0.55           u0      = 0.049           ua      = 6e-010          ub      = 1.2e-018
+uc      = 0               vsat    = 130000          a0      = 1               ags     = 0
+a1      = 0               a2      = 1               b0      = 0               b1      = 0
+keta    = 0.04            dwg     = 0               dwb     = 0               pclm    = 0.02
+pdiblc1 = 0.001           pdiblc2 = 0.001           pdiblcb = -0.005          drout   = 0.5
+pvag    = 1e-020          delta   = 0.01            pscbe1  = 8.14e+008       pscbe2  = 1e-007
+fprout  = 0.2             pdits   = 0.08            pditsd  = 0.23            pditsl  = 2300000
+rsh     = 5               rdsw    = 210             rsw     = 80              rdw     = 80
+rdswmin = 0               rdwmin  = 0               rswmin  = 0               prwg    = 0
+prwb    = 0               wr      = 1               alpha0  = 0.074           alpha1  = 0.005
+beta0   = 30              agidl   = 0.0002          bgidl   = 2.1e+009        cgidl   = 0.0002
+egidl   = 0.8             aigbacc = 0.012           bigbacc = 0.0028          cigbacc = 0.002
+nigbacc = 1               aigbinv = 0.014           bigbinv = 0.004           cigbinv = 0.004
+eigbinv = 1.1             nigbinv = 3               aigc    = 0.015211        bigc    = 0.0027432
+cigc    = 0.002           aigsd   = 0.015211        bigsd   = 0.0027432       cigsd   = 0.002
+nigc    = 1               poxedge = 1               pigcd   = 1               ntox    = 1
+xrcrg1  = 12              xrcrg2  = 5
+cgso    = 1.1e-010        cgdo    = 1.1e-010        cgbo    = 2.56e-011       cgdl    = 2.653e-010
+cgsl    = 2.653e-010      ckappas = 0.03            ckappad = 0.03            acde    = 1
+moin    = 15              noff    = 0.9             voffcv  = 0.02
+kt1     = -0.11           kt1l    = 0               kt2     = 0.022           ute     = -1.5
+ua1     = 4.31e-009       ub1     = 7.61e-018       uc1     = -5.6e-011       prt     = 0
+at      = 33000
+fnoimod = 1               tnoimod = 0
+jss     = 0.0001          jsws    = 1e-011          jswgs   = 1e-010          njs     = 1
+ijthsfwd= 0.01            ijthsrev= 0.001           bvs     = 10              xjbvs   = 1
+jsd     = 0.0001          jswd    = 1e-011          jswgd   = 1e-010          njd     = 1
+ijthdfwd= 0.01            ijthdrev= 0.001           bvd     = 10              xjbvd   = 1
+pbs     = 1               cjs     = 0.0005          mjs     = 0.5             pbsws   = 1
+cjsws   = 5e-010          mjsws   = 0.33            pbswgs  = 1               cjswgs  = 3e-010
+mjswgs  = 0.33            pbd     = 1               cjd     = 0.0005          mjd     = 0.5
+pbswd   = 1               cjswd   = 5e-010          mjswd   = 0.33            pbswgd  = 1
+cjswgd  = 5e-010          mjswgd  = 0.33            tpb     = 0.005           tcj     = 0.001
+tpbsw   = 0.005           tcjsw   = 0.001           tpbswg  = 0.005           tcjswg  = 0.001
+xtis    = 3               xtid    = 3
+dmcg    = 0               dmci    = 0               dmdg    = 0               dmcgt   = 0
+dwj     = 0               xgw     = 0               xgl     = 0
+rshg    = 0.4             gbmin   = 1e-010          rbpb    = 5               rbpd    = 15
+rbps    = 15              rbdb    = 15              rbsb    = 15              ngcon   = 1
.model  pmos  pmos  level = 54
+version = 4.0             binunit = 1               paramchk= 1               mobmod  = 0
+capmod  = 2               igcmod  = 1               igbmod  = 1               geomod  = 1
+diomod  = 1               rdsmod  = 0               rbodymod= 1               rgatemod= 1
+permod  = 1               acnqsmod= 0               trnqsmod= 0
+tnom    = 27              toxe    = 1.82e-009       toxp    = 1.5e-009        toxm    = 1.82e-009
+dtox    = 3.2e-010        epsrox  = 3.9             wint    = 5e-009          lint    = 0
+ll      = 0               wl      = 0               lln     = 1               wln     = 1
+lw      = 0               ww      = 0               lwn     = 1               wwn     = 1
+lwl     = 0               wwl     = 0               xpart   = 0               toxref  = 1.82e-009
+vth0    = -0.587          k1      = 0.4             k2      = -0.01           k3      = 0
+k3b     = 0               w0      = 2.5e-006        dvt0    = 1               dvt1    = 2
+dvt2    = -0.032          dvt0w   = 0               dvt1w   = 0               dvt2w   = 0
+dsub    = 0.1             minv    = 0.05            voffl   = 0               dvtp0   = 1e-011
+dvtp1   = 0.05            lpe0    = 0               lpeb    = 0               xj      = 1.4e-008
+ngate   = 1e+023          ndep    = 2.44e+018       nsd     = 2e+020          phin    = 0
+cdsc    = 0               cdscb   = 0               cdscd   = 0               cit     = 0
+voff    = -0.126          nfactor = 1.8             eta0    = 0.0125          etab    = 0
+vfb     = 0.55            u0      = 0.021           ua      = 2e-009          ub      = 5e-019
+uc      = 0               vsat    = 90000           a0      = 1               ags     = 1e-020
+a1      = 0               a2      = 1               b0      = 0               b1      = 0
+keta    = -0.047          dwg     = 0               dwb     = 0               pclm    = 0.12
+pdiblc1 = 0.001           pdiblc2 = 0.001           pdiblcb = 3.4e-008        drout   = 0.56
+pvag    = 1e-020          delta   = 0.01            pscbe1  = 8.14e+008       pscbe2  = 9.58e-007
+fprout  = 0.2             pdits   = 0.08            pditsd  = 0.23            pditsl  = 2300000
+rsh     = 5               rdsw    = 250             rsw     = 75              rdw     = 75
+rdswmin = 0               rdwmin  = 0               rswmin  = 0               prwg    = 0
+prwb    = 0               wr      = 1               alpha0  = 0.074           alpha1  = 0.005
+beta0   = 30              agidl   = 0.0002          bgidl   = 2.1e+009        cgidl   = 0.0002
+egidl   = 0.8             aigbacc = 0.012           bigbacc = 0.0028          cigbacc = 0.002
+nigbacc = 1               aigbinv = 0.014           bigbinv = 0.004           cigbinv = 0.004
+eigbinv = 1.1             nigbinv = 3               aigc    = 0.0097          bigc    = 0.00125
+cigc    = 0.0008          aigsd   = 0.0097          bigsd   = 0.00125         cigsd   = 0.0008
+nigc    = 1               poxedge = 1               pigcd   = 1               ntox    = 1
+xrcrg1  = 12              xrcrg2  = 5
+cgso    = 1.1e-010        cgdo    = 1.1e-010        cgbo    = 2.56e-011       cgdl    = 2.653e-010
+cgsl    = 2.653e-010      ckappas = 0.03            ckappad = 0.03            acde    = 1
+moin    = 15              noff    = 0.9             voffcv  = 0.02
+kt1     = -0.11           kt1l    = 0               kt2     = 0.022           ute     = -1.5
+ua1     = 4.31e-009       ub1     = 7.61e-018       uc1     = -5.6e-011       prt     = 0
+at      = 33000
+fnoimod = 1               tnoimod = 0
+jss     = 0.0001          jsws    = 1e-011          jswgs   = 1e-010          njs     = 1
+ijthsfwd= 0.01            ijthsrev= 0.001           bvs     = 10              xjbvs   = 1
+jsd     = 0.0001          jswd    = 1e-011          jswgd   = 1e-010          njd     = 1
+ijthdfwd= 0.01            ijthdrev= 0.001           bvd     = 10              xjbvd   = 1
+pbs     = 1               cjs     = 0.0005          mjs     = 0.5             pbsws   = 1
+cjsws   = 5e-010          mjsws   = 0.33            pbswgs  = 1               cjswgs  = 3e-010
+mjswgs  = 0.33            pbd     = 1               cjd     = 0.0005          mjd     = 0.5
+pbswd   = 1               cjswd   = 5e-010          mjswd   = 0.33            pbswgd  = 1
+cjswgd  = 5e-010          mjswgd  = 0.33            tpb     = 0.005           tcj     = 0.001
+tpbsw   = 0.005           tcjsw   = 0.001           tpbswg  = 0.005           tcjswg  = 0.001
+xtis    = 3               xtid    = 3
+dmcg    = 0               dmci    = 0               dmdg    = 0               dmcgt   = 0
+dwj     = 0               xgw     = 0               xgl     = 0
+rshg    = 0.4             gbmin   = 1e-010          rbpb    = 5               rbpd    = 15
+rbps    = 15              rbdb    = 15              rbsb    = 15              ngcon   = 1
.backanno
.end